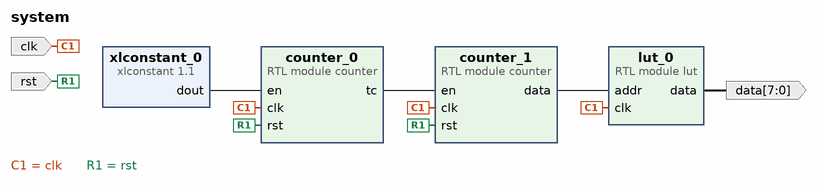
[diagram p0: block diagram of the top level]
# Vivado block design system, xc7z010clg400-1, Vivado 2018.2
create_bd_design system

create_bd_port -dir I -type clk clk
set_property -dict {CONFIG.ASSOCIATED_RESET rst} [get_bd_ports clk]
create_bd_port -dir I -type rst rst
create_bd_port -dir O -from 7 -to 0 data

create_bd_cell -type module -reference counter counter_0
set_property -dict {CONFIG.DATA_WIDTH 9 CONFIG.DATA_MAX 488} [get_bd_cells counter_0]
create_bd_cell -type module -reference counter counter_1
create_bd_cell -type module -reference lut lut_0
create_bd_cell -type ip -vlnv xilinx.com:ip:xlconstant:1.1 xlconstant_0

# ---- connections ----

connect_bd_net [get_bd_pins xlconstant_0/dout] [get_bd_pins counter_0/en]
connect_bd_net [get_bd_pins counter_0/tc] [get_bd_pins counter_1/en]
connect_bd_net [get_bd_pins counter_1/data] [get_bd_pins lut_0/addr]
connect_bd_net -net clk_0_1 [get_bd_ports clk] [get_bd_pins counter_0/clk] [get_bd_pins counter_1/clk] [get_bd_pins lut_0/clk]
connect_bd_net -net rst_0_1 [get_bd_ports rst] [get_bd_pins counter_0/rst] [get_bd_pins counter_1/rst]
connect_bd_net [get_bd_pins lut_0/data] [get_bd_ports data]

validate_bd_design
save_bd_design
